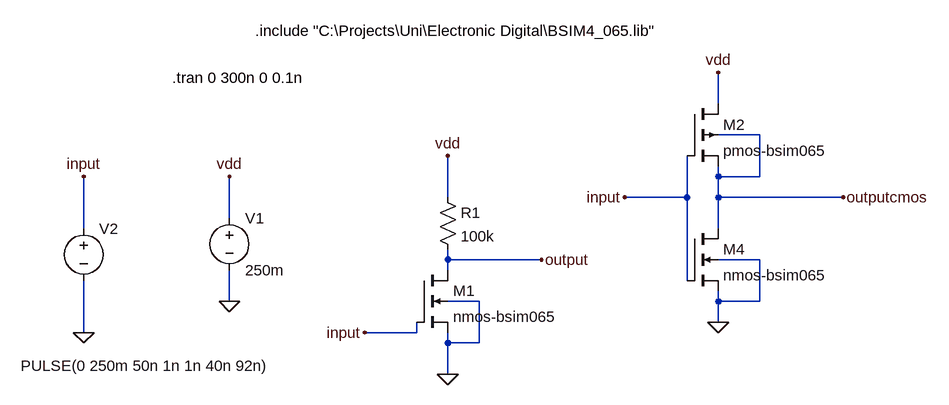
[diagram p0: schematic cmos_inverter.asc]
cmos_inverter.asc, the LTspice schematic file:
Version 4.1
SHEET 1 940 680
WIRE 592 -16 592 -64
WIRE 656 32 592 32
WIRE 592 96 592 80
WIRE 656 96 656 32
WIRE 656 96 592 96
WIRE 176 128 176 64
WIRE 544 128 544 64
WIRE 544 128 448 128
WIRE 592 128 592 96
WIRE 784 128 592 128
WIRE -160 160 -160 96
WIRE -384 176 -384 96
WIRE 592 176 592 128
WIRE 176 224 176 208
WIRE 320 224 176 224
WIRE 656 224 592 224
WIRE 176 240 176 224
WIRE 544 256 544 128
WIRE -160 288 -160 240
WIRE 224 288 176 288
WIRE 592 288 592 272
WIRE 656 288 656 224
WIRE 656 288 592 288
WIRE 592 320 592 288
WIRE -384 336 -384 256
WIRE 128 336 128 320
WIRE 128 336 48 336
WIRE 176 352 176 336
WIRE 224 352 224 288
WIRE 224 352 176 352
WIRE 176 400 176 352
FLAG 176 400 0
FLAG -160 288 0
FLAG -160 96 vdd
FLAG 176 64 vdd
FLAG 48 336 input
FLAG 320 224 output
FLAG -384 336 0
FLAG -384 96 input
FLAG 592 -64 vdd
FLAG 448 128 input
FLAG 784 128 outputcmos
FLAG 592 320 0
SYMBOL res 160 112 R0
SYMATTR InstName R1
SYMATTR Value 100k
SYMBOL voltage -160 144 R0
WINDOW 123 0 0 Left 0
WINDOW 39 0 0 Left 0
SYMATTR InstName V1
SYMATTR Value 250m
SYMBOL voltage -384 160 R0
WINDOW 3 -97 227 Left 2
WINDOW 123 0 0 Left 0
WINDOW 39 0 0 Left 0
SYMATTR InstName V2
SYMATTR Value PULSE(0 250m 50n 1n 1n 40n 92n)
SYMBOL nmos4 128 240 R0
SYMATTR InstName M1
SYMATTR Value nmos-bsim065
SYMATTR Value2 l=70n w=160n
SYMBOL nmos4 544 176 R0
SYMATTR InstName M4
SYMATTR Value nmos-bsim065
SYMATTR Value2 l=70n w=160n
SYMBOL pmos4 544 -16 R0
SYMATTR InstName M2
SYMATTR Value pmos-bsim065
SYMATTR Value2 l=70n w=200n
TEXT -120 -128 Left 2 !.include "C:\\Projects\\Uni\\Electronic Digital\\BSIM4_065.lib"
TEXT -248 -56 Left 2 !.tran 0 300n 0 0.1n

The netlist it stands for:
* cmos_inverter.asc
R1 vdd output 100k
V1 vdd 0 250m
V2 input 0 PULSE(0 250m 50n 1n 1n 40n 92n)
M1 output input 0 0 nmos-bsim065 l=70n w=160n
M4 outputcmos input 0 0 nmos-bsim065 l=70n w=160n
M2 vdd input outputcmos outputcmos pmos-bsim065 l=70n w=200n
.model NMOS NMOS
.model PMOS PMOS
.lib standard.mos
.include "C:\Projects\Uni\Electronic Digital\BSIM4_065.lib"
.tran 0 300n 0 0.1n
.backanno
.end